# Altium project CanhBaoLu.PrjPcb (part 1 of 2)
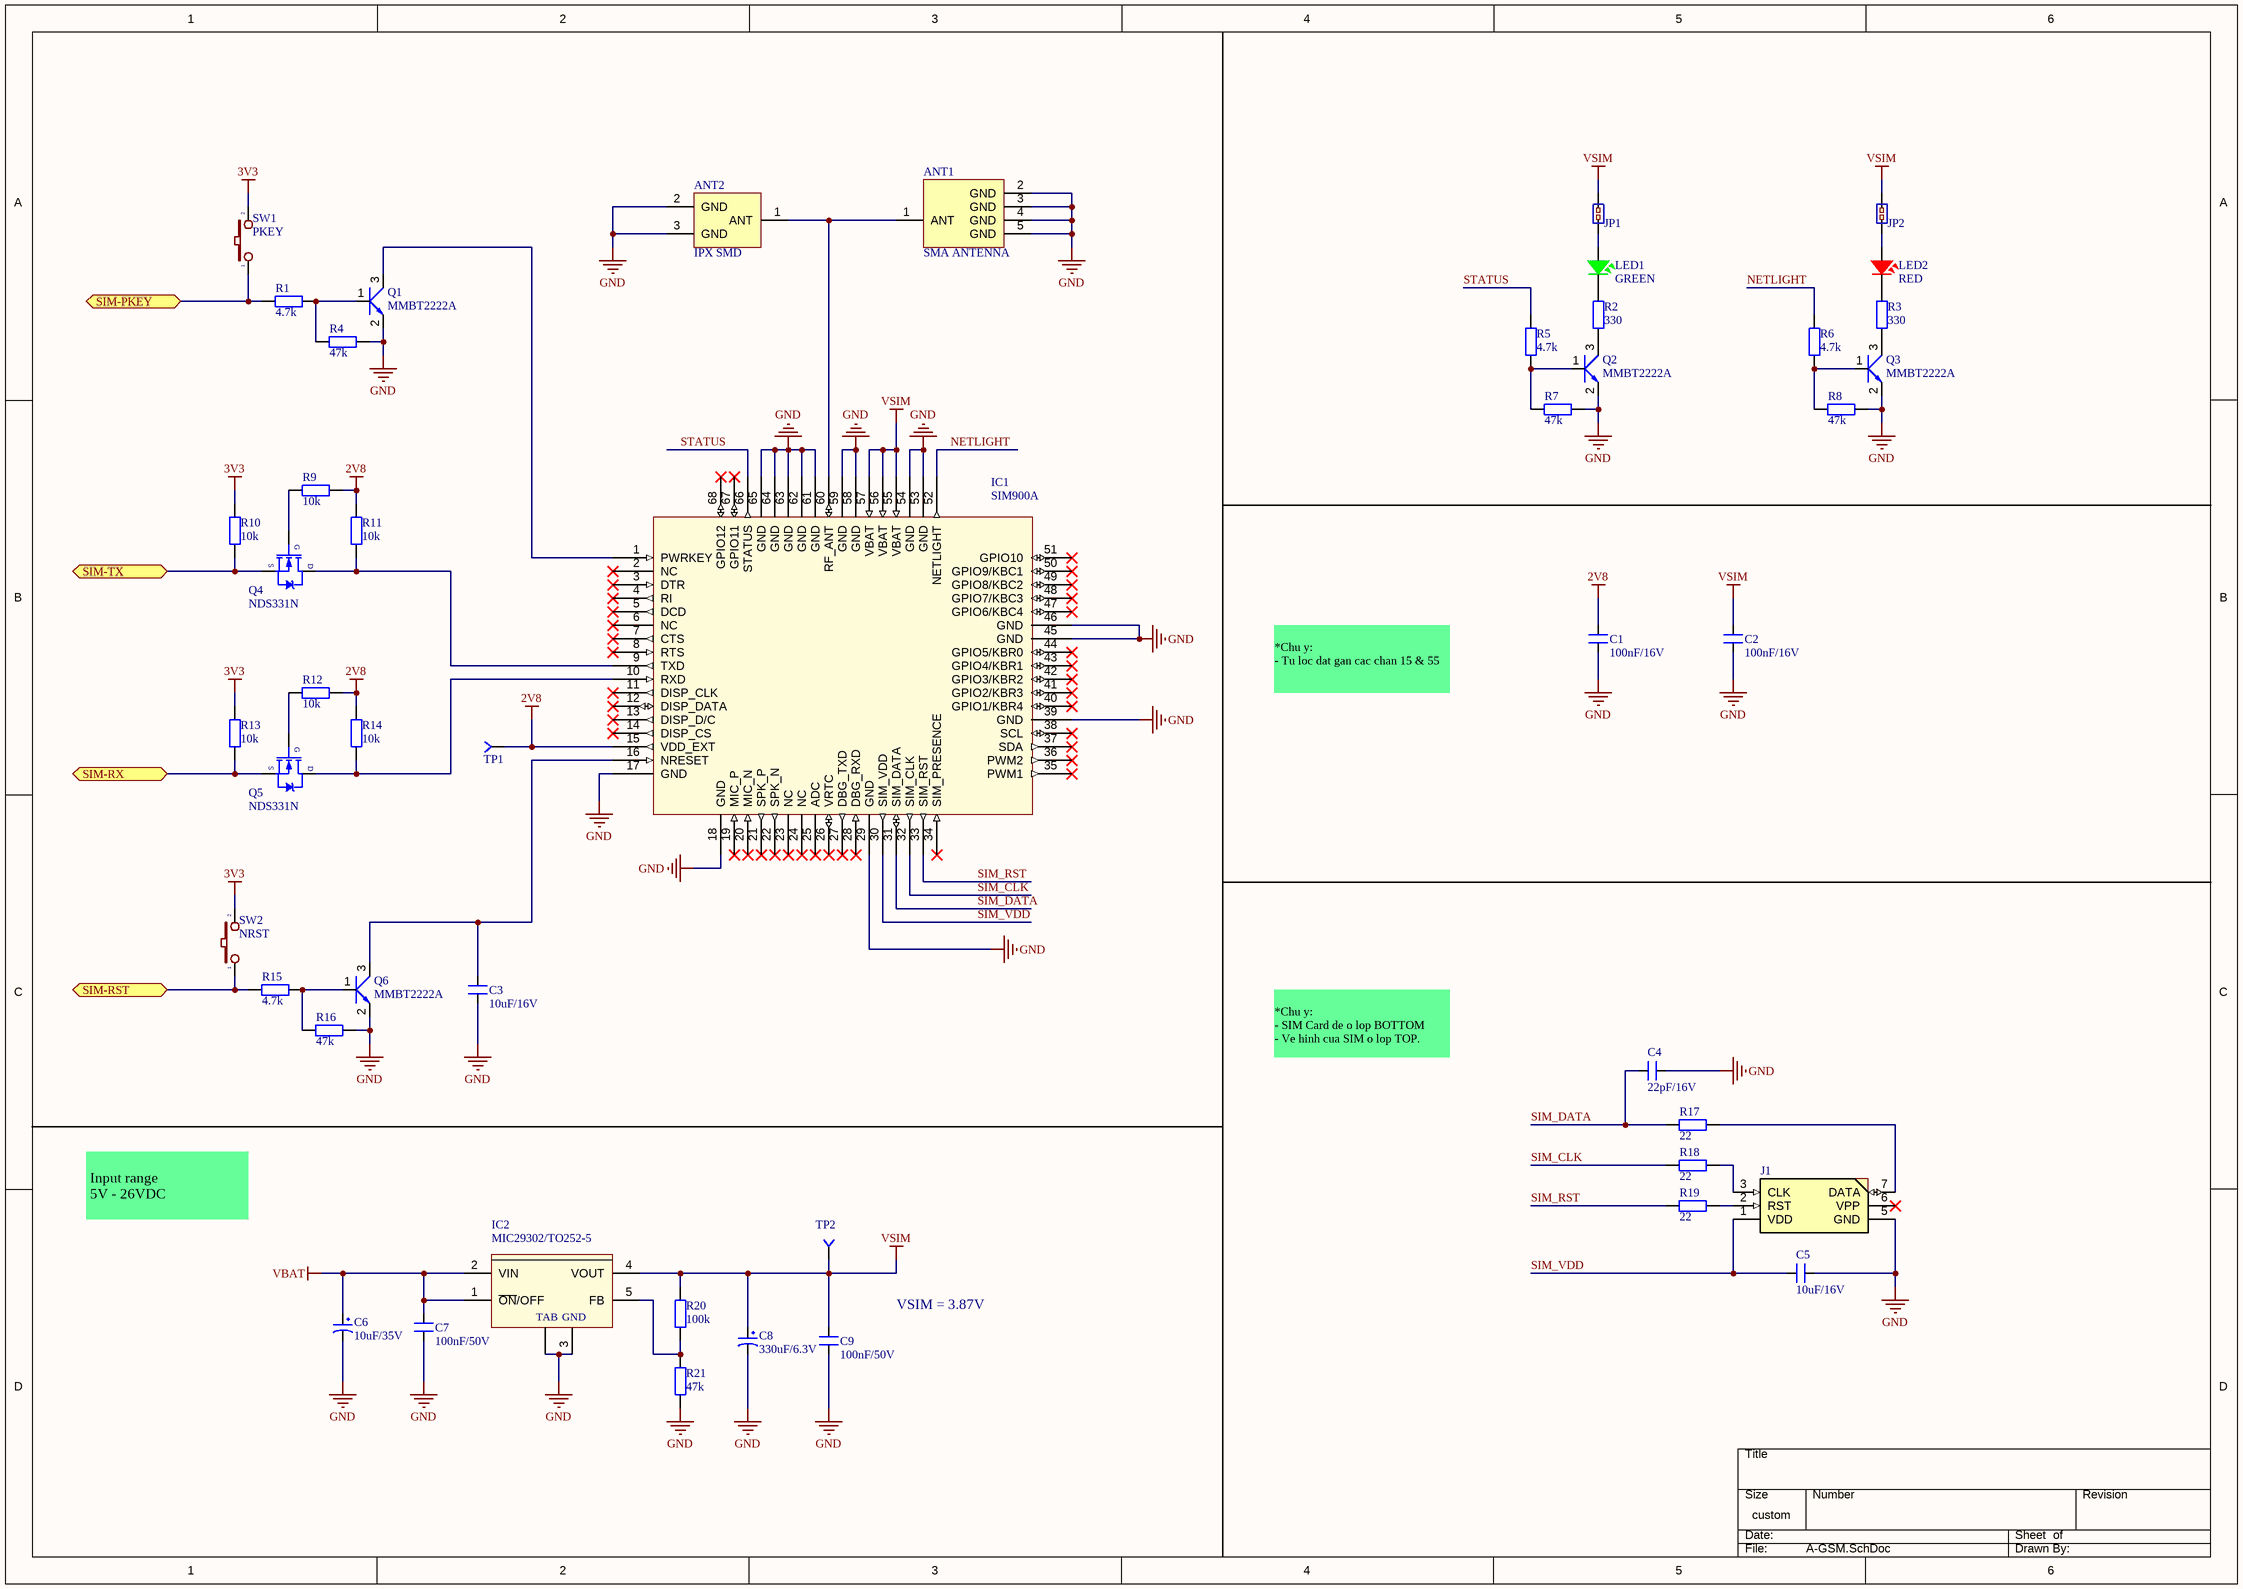
[diagram p0: A-GSM.SchDoc]
3 sheets, 148 parts. Net scope: flat (ports and power ports of the same name join across sheets).
Board file: PCB1.PcbDoc
Sheets:
  A-GSM.SchDoc
  A-Main.SchDoc
  A-Power.SchDoc

## Sheet A-GSM.SchDoc
size 420 x 297 mm; SheetNumber: 02; SheetTotal: 03

### Parts
ANT1  value SMA ANTENNA  [ANT-SMA-ST-F]  (hidden comment: ANTEN-SMA)
ANT2  value IPX SMD  [ANT-IPX-SMD]  (hidden comment: ANTEN-IPX)
C1  100nF/16V  [C0805-2012]
C2  100nF/16V  [C0805-2012]
C3  10uF/16V  [C0805-2012]
C4  22pF/16V  [C0603-1608]
C5  10uF/16V  [C0805-2012]
C6  10uF/35V  [CAP_TANTA_10UF_35V]
C7  100nF/50V  [C0805-2012]
C8  330uF/6.3V  [CAP_TANTA-3528]
C9  100nF/50V  [C0805-2012]
IC1  SIM900A/SIMCOM  [SIM900A]  (value not drawn)
IC2  MIC29302/TO252-5  [MIC29302A]
J1  SIM-FMS006-2620-0  [SIM-FMS006-2620-0]  (value not drawn)
JP1  JP2-ShortingJumper  [Header_2]  (value not drawn)
JP2  JP2-ShortingJumper  [Header_2]  (value not drawn)
LED1  GREEN  [Led 0805G]
LED2  RED  [Led 0805R]
Q1  MMBT2222A  [MMBT2222A]
Q2  MMBT2222A  [MMBT2222A]
Q3  MMBT2222A  [MMBT2222A]
Q4  NDS331N  [NDS331N]
Q5  NDS331N  [NDS331N]
Q6  MMBT2222A  [MMBT2222A]
R1  Resistance (Ohms): 4.7k  [RESC2012(0805)]
R2  Resistance (Ohms): 330  [RESC2012(0805)]
R3  Resistance (Ohms): 330  [RESC2012(0805)]
R4  Resistance (Ohms): 47k  [RESC2012(0805)]
R5  Resistance (Ohms): 4.7k  [RESC2012(0805)]
R6  Resistance (Ohms): 4.7k  [RESC2012(0805)]
R7  Resistance (Ohms): 47k  [RESC2012(0805)]
R8  Resistance (Ohms): 47k  [RESC2012(0805)]
R9  Resistance (Ohms): 10k  [RESC2012(0805)]
R10  Resistance (Ohms): 10k  [RESC2012(0805)]
R11  Resistance (Ohms): 10k  [RESC2012(0805)]
R12  Resistance (Ohms): 10k  [RESC2012(0805)]
R13  Resistance (Ohms): 10k  [RESC2012(0805)]
R14  Resistance (Ohms): 10k  [RESC2012(0805)]
R15  Resistance (Ohms): 4.7k  [RESC2012(0805)]
R16  Resistance (Ohms): 47k  [RESC2012(0805)]
R17  Resistance (Ohms): 22  [RESC2012(0805)]
R18  Resistance (Ohms): 22  [RESC2012(0805)]
R19  Resistance (Ohms): 22  [RESC2012(0805)]
R20  Resistance (Ohms): 100k  [RESC2012(0805)]
R21  Resistance (Ohms): 47k  [RESC2012(0805)]
SW1  PKEY  [BTN-EVQ-11A04M]
SW2  NRST  [BTN-EVQ-11A04M]
TP1  Test Point  [Test_point_VIA06]  (value not drawn)
TP2  Test Point  [Test_point_VIA06]  (value not drawn)

### Ports
SIM-PKEY (bidir), SIM-RST (bidir), SIM-RX (bidir), SIM-TX (bidir)

### Nets
2V8: C1.1 IC1.15(VDD_EXT) R9.2 R11.1 R12.2 R14.1 TP1.1
3V3: R10.1 R13.1 SW1.2 SW2.2
GND: ANT1.2(GND) ANT1.3(GND) ANT1.4(GND) ANT1.5(GND) ANT2.2(GND) ANT2.3(GND) C1.2 C2.2 C3.2 C4.2 C5.2 C6.2 C7.2 C8.2 C9.2 IC1.17(GND) IC1.18(GND) IC1.29(GND) IC1.39(GND) IC1.45(GND) IC1.46(GND) IC1.53(GND) IC1.54(GND) IC1.58(GND) IC1.59(GND) IC1.61(GND) IC1.62(GND) IC1.63(GND) IC1.64(GND) IC1.65(GND) IC2.3(GND) IC2.6(TAB) J1.5(GND) Q1.2(E) Q2.2(E) Q3.2(E) Q6.2(E) R4.2 R7.2 R8.2 R16.2 R21.1
VBAT: C6.1 C7.1 IC2.1(~{ON}/OFF) IC2.2(VIN)
VSIM: C2.1 C8.1 C9.1 IC1.55(VBAT) IC1.56(VBAT) IC1.57(VBAT) IC2.4(VOUT) JP1.2 JP2.2 R20.1 TP2.1
NETLIGHT: IC1.52(NETLIGHT) R6.2
SIM_CLK: IC1.32(SIM_CLK) R18.2
SIM_DATA: C4.1 IC1.31(SIM_DATA) R17.2
SIM_RST: IC1.33(SIM_RST) R19.2
SIM_VDD: C5.1 IC1.30(SIM_VDD) J1.1(VDD)
STATUS: IC1.66(STATUS) R5.2
NetANT1_1: ANT1.1(ANT) ANT2.1(ANT) IC1.60(RF_ANT)
NetC3_1: C3.1 IC1.16(NRESET) Q6.3(C)
NetIC1_1: IC1.1(PWRKEY) Q1.3(C)
NetIC1_9: IC1.9(TXD) Q4.3(D) R11.2
NetIC1_10: IC1.10(RXD) Q5.3(D) R14.2
NetIC2_5: IC2.5(FB) R20.2 R21.2
NetJ1_2: J1.2(RST) R19.1
NetJ1_3: J1.3(CLK) R18.1
NetJ1_7: J1.7(DATA) R17.1
NetJP1_1: JP1.1 LED1.1(A)
NetJP2_1: JP2.1 LED2.1(A)
NetLED1_2: LED1.2(K) R2.2
NetLED2_2: LED2.2(K) R3.2
NetQ1_1: Q1.1(B) R1.2 R4.1
NetQ2_1: Q2.1(B) R5.1 R7.1
NetQ2_3: Q2.3(C) R2.1
NetQ3_1: Q3.1(B) R6.1 R8.1
NetQ3_3: Q3.3(C) R3.1
NetQ4_1: Q4.1(G) R9.1
NetQ4_2: Q4.2(S) R10.2 ; port SIM-TX
NetQ5_1: Q5.1(G) R12.1
NetQ5_2: Q5.2(S) R13.2 ; port SIM-RX
NetQ6_1: Q6.1(B) R15.2 R16.1
NetR1_1: R1.1 SW1.1 ; port SIM-PKEY
NetR15_1: R15.1 SW2.1 ; port SIM-RST

Not connected (* = marked no-connect by the designer): IC1 2(NC)* 3(DTR)* 4(RI)* 5(DCD)* 6(NC)* 7(CTS)* 8(RTS)* 11(DISP_CLK)* 12(DISP_DATA)* 13(DISP_D/C)* 14(DISP_CS)* 19(MIC_P)* 20(MIC_N)* 21(SPK_P)* 22(SPK_N)* 23(NC)* 24(NC)* 25(ADC)* 26(VRTC)* 27(DBG_TXD)* 28(DBG_RXD)* 34(SIM_PRESENCE)* 35(PWM1)* 36(PWM2)* 37(SDA)* 38(SCL)* 40(GPIO1/KBR4)* 41(GPIO2/KBR3)* 42(GPIO3/KBR2)* 43(GPIO4/KBR1)* 44(GPIO5/KBR0)* 47(GPIO6/KBC4)* 48(GPIO7/KBC3)* 49(GPIO8/KBC2)* 50(GPIO9/KBC1)* 51(GPIO10)* 67(GPIO11)* 68(GPIO12)*; J1 6(VPP)*

### Notes on the sheet
- *Chu y:
  - Tu loc dat gan cac chan 15 & 55
- *Chu y:
  - SIM Card de o lop BOTTOM
  - Ve hinh cua SIM o lop TOP.
- Input range
  5V - 26VDC
- VSIM = 3.87V
- THIS DOCUMENT AND THE DATA DISCLOSED HEREIN OR
- HEREWITH IS THE PROPERTY OF ALTIUM LIMITED AND MAY
- DWG NO:
- REVISION
- REV:
- DESCRIPTION
- DATE
- APPROVED
- BE FREELY DISTRIBUTED IN WHOLE. NO RIGHTS ARE
- RESERVED OR EXPRESS OR IMPLIED WARANTEE GIVEN.
- ENG:
- APPROVALS
- PROJECT
- DSN:
- CHK:
- REFERENCE DOCUMENTS
- PROJECT REVISION:
- TITLE
- DOCUMENT REVISION:
- DESIGN ITEM:
- BOM:
- FAB DWG:
- PCB DWG:
- ASSY DWG:
- SCALE:
- A3
- SIZE
- CAGE CODE
- FILE NAME
- DWG NO.
- SHEET
- OF
- REV

### Library data of the parts
ANT1 = ANTEN-SMA: SMA Right-Angle PCB Female Antenna; Supplier Link: http://tme.vn/Product.aspx?id=1981#page=pro_info; ComponentLink1Description: http://tme.vn/upload/PICTURE/SMA-ST-DIM.gif; ComponentLink1URL: http://tme.vn/upload/PICTURE/SMA-ST-DIM.gif; Supplier 1: TME.VN
ANT2 = ANTEN-IPX: IPX, SMD, ANTENNA; Supplier Link: http://tme.vn/Product.aspx?id=1106#page=pro_info; ComponentLink1Description: http://tme.vn/upload/pdf/IPXSM66AL.pdf; ComponentLink1URL: http://tme.vn/upload/pdf/IPXSM66AL.pdf; Supplier 1: TME.VN
C1 C2 = CAP-CER/100nF/16V/X7R/0805: CAP CER 0.1UF 16V X7R 0805; Manufacturer: Kemet; Manufacturer Part Number: C0805C104K4RACTU; Capacitance: 0.10µF; Tolerance: ±10%; Supplier 1: Digi-Key; RoHS: RoHS Compliant; Category: Capacitors; Stock 1: 366123; Pricing 1: 1=0.11, 10=0.075, 50=0.0432, 100=0.0356, 250=0.03, 500=0.02512, 1000=0.02063 (USD); Packaging: Cut Tape (CT); Voltage - Rated: 16V; Temperature Coefficient: X7R; Mounting Type: Surface Mount, MLCC; Operating Temperature: -55°C ~ 125°C; Applications: General Purpose; Ratings: -; Package / Case: 0805 (2012 Metric); Size / Dimension: 0.079" L x 0.049" W (2.00mm x 1.25mm); Height - Seated (Max): -; Thickness (Max): 0.035" (0.88mm); Lead Spacing: -; Features: Low ESL; Lead Style: -; ComponentLink1URL: http://www.kemet.com/docfinder?Partnumber=C0805C104K4RACTU; ComponentLink1Description: http://www.kemet.com/docfinder?Partnumber=C0805C104K4RACTU; Supplier Part Number 1: 399-1167-1-ND
C3 C5 = CAP-CER/10UF/16V/X5R/0805: CAP CER 10UF 16V X5R 0805; Manufacturer: Murata Electronics North America; Manufacturer Part Number: GRM21BR61C106KE15L; Capacitance: 10µF; Tolerance: ±10%; Supplier 1: Digi-Key; Supplier Part Number 1: 490-3886-1-ND; Stock: 1364697; Pricing: 1=0.2, 10=0.136, 50=0.0826, 100=0.0693, 250=0.05612, 500=0.0495, 1000=0.04208 (USD); Packaging: Cut Tape (CT); Voltage - Rated: 16V; Temperature Coefficient: X5R; Mounting Type: Surface Mount, MLCC; Operating Temperature: -55°C ~ 85°C; Applications: General Purpose; Ratings: -; Package / Case: 0805 (2012 Metric); Size / Dimension: 0.079" L x 0.049" W (2.00mm x 1.25mm); Height - Seated (Max): -; Thickness (Max): 0.053" (1.35mm); Lead Spacing: -; Features: -; Lead Style: -; ComponentLink1URL: http://www.murata.com/~/media/webrenewal/support/library/catalog/products/capacitor/mlcc/c02e.ashx; ComponentLink1Description: http://www.murata.com/~/media/webrenewal/support/library/catalog/products/capacitor/mlcc/c02e.ashx
C4 = CAP-CER/22pF/16V/NP0/0603: CAP CER 22PF 16V NP0 0603; Manufacturer: Kemet; Manufacturer Part Number: C0603C220K4GACTU; Tolerance: ±10%; Temperature Coefficient: C0G, NP0; Supplier 1: Digi-Key; Supplier Part Number 1: 399-9031-1-ND; Stock: 40435; Pricing: 1=0.1, 10=0.055, 25=0.0392, 50=0.0298, 100=0.0252, 250=0.02064, 1000=0.0135 (USD); Packaging: Cut Tape (CT); Capacitance: 22pF; Voltage - Rated: 16V; Mounting Type: Surface Mount, MLCC; Operating Temperature: -55°C ~ 125°C; Applications: General Purpose; Ratings: -; Package / Case: 0603 (1608 Metric); Size / Dimension: 0.063" L x 0.031" W (1.60mm x 0.80mm); Height - Seated (Max): -; Thickness (Max): 0.034" (0.87mm); Lead Spacing: -; Features: -; Lead Style: -; ComponentLink1URL: http://www.kemet.com/docfinder?Partnumber=C0603C220K4GACTU; ComponentLink1Description: http://www.kemet.com/docfinder?Partnumber=C0603C220K4GACTU
C6 = CAP-TANT/10uF/35V/2413: CAP TANT 10UF 35V 10% 2413; Manufacturer: Kemet; Manufacturer Part Number: T491C106K035AT; Manufacturer Size Code: C; Capacitance: 10µF; ESR (Equivalent Series Resistance): 1.6 Ohm; Type: Molded; Lifetime @ Temp.: 2000 Hrs @ 85°C; Supplier 1: Digi-Key; RoHS: RoHS Compliant; Category: Capacitors; Stock 1: 21227; Pricing 1: 1=0.99, 10=0.838, 50=0.6166, 100=0.4901, 250=0.41108 (USD); Packaging: Cut Tape (CT); Tolerance: ±10%; Voltage - Rated: 35V; Operating Temperature: -55°C ~ 125°C; Mounting Type: Surface Mount; Package / Case: 2413 (6032 Metric); Size / Dimension: 0.236" L x 0.126" W (6.00mm x 3.20mm); Height - Seated (Max): 0.110" (2.80mm); Lead Spacing: -; Features: General Purpose; ComponentLink1URL: http://www.kemet.com/Lists/ProductCatalog/Attachments/254/KEM_T2005_T491.pdf; ComponentLink1Description: http://www.kemet.com/Lists/ProductCatalog/Attachments/254/KEM_T2005_T491.pdf; Supplier Part Number 1: 399-8333-1-ND
C7 C9 = CAP-CER/100nF/50V/X7R/0805: CAP CER 0.1UF 50V X7R 0805; Manufacturer: AVX Corporation; Manufacturer Part Number: 08055C104KAT2A; Capacitance: 0.10µF; Tolerance: ±10%; Supplier 1: Digi-Key; RoHS: RoHS Compliant; Category: Capacitors; Stock 1: 6127704; Pricing 1: 1=0.1, 10=0.036, 100=0.0165, 250=0.01352, 500=0.01156, 1000=0.009 (USD); Packaging: Cut Tape (CT); Voltage - Rated: 50V; Temperature Coefficient: X7R; Mounting Type: Surface Mount, MLCC; Operating Temperature: -55°C ~ 125°C; Applications: General Purpose; Ratings: -; Package / Case: 0805 (2012 Metric); Size / Dimension: 0.079" L x 0.049" W (2.01mm x 1.25mm); Height - Seated (Max): -; Thickness (Max): 0.037" (0.94mm); Lead Spacing: -; Features: -; Lead Style: -; ComponentLink1URL: http://datasheets.avx.com/X7RDielectric.pdf; ComponentLink1Description: http://datasheets.avx.com/X7RDielectric.pdf; Supplier Part Number 1: 478-1395-1-ND
C8 = CAP-TANT/330uF/6.3V/3528: CAP TAN 330UF 20% 6V 3528-21; Manufacturer: Kemet; Manufacturer Part Number: T490B337M006ATE800; Manufacturer Size Code: B; Capacitance: 330µF; Voltage - Rated: 6.3V; ESR (Equivalent Series Resistance): 800 mOhm; Type: Molded; Lifetime @ Temp.: 1000 Hrs @ 85°C; Supplier 1: Digi-Key; RoHS: RoHS Compliant; Category: Capacitors; Stock 1: 5471; Pricing 1: 1=1.21, 10=1.011, 50=0.817, 100=0.645, 250=0.53752, 500=0.48376, 1000=0.44075 (USD); Packaging: Cut Tape (CT); Tolerance: ±20%; Operating Temperature: -55°C ~ 40°C; Mounting Type: Surface Mount; Package / Case: 1411 (3528 Metric); Size / Dimension: 0.138" L x 0.110" W (3.50mm x 2.80mm); Height - Seated (Max): 0.083" (2.10mm); Lead Spacing: -; Features: General Purpose; ComponentLink1URL: http://capacitoredge.kemet.com/capedge2/DataSheet?pn=T490B337M006ATE800; ComponentLink1Description: http://capacitoredge.kemet.com/capedge2/DataSheet?pn=T490B337M006ATE800; Supplier Part Number 1: 399-11976-1-ND
IC1 = SIM900A/SIMCOM: SIM900A, Dual-band GSM/GPRS 900/1800MHz Module; Manufacturer: SIMCOM; ComponentLink1Description: http://www.tme.vn/upload/pdf/SIM900A_HD_V1.01.pdf; Supplier Link: http://www.tme.vn/Product.aspx?id=1575#page=pro_info; ComponentLink1URL: http://www.tme.vn/upload/pdf/SIM900A_HD_V1.01.pdf; Manufacturer Part Number: SIM900A
IC2 = MIC29302/TO252-5: IC REG LDO ADJ 3A TO252-5; Manufacturer: Microchip Technology; Manufacturer Part Number: MIC29302AWD-TR; Regulator Topology: Positive Adjustable; Voltage - Output: 1.24 V ~ 15 V; Voltage - Dropout (Typical): 0.45V @ 3A; Number of Regulators: 1; Voltage - Input: 3 V ~ 16 V; Datasheet: http://www.micrel.com/_PDF/mic29150.pdf; Supplier VN: http://thegioiic.com/products/mic29302; Supplier 1: Digi-Key; RoHS: RoHS Compliant; Category: Integrated Circuits (ICs); Stock 1: 4076; Pricing 1: 1=1.87, 25=1.56, 100=1.42 (USD); Packaging: Cut Tape (CT); Current - Output: 3A; Current - Limit (Min): 3A; Operating Temperature: -40°C ~ 125°C; Mounting Type: Surface Mount; Package / Case: TO-263-6, D²Pak (5 Leads + Tab), TO-263BA; Supplier Device Package: TO-252-5; ComponentLink1URL: http://www.microchip.com/mymicrochip/filehandler.aspx?ddocname=en580808; ComponentLink1Description: http://www.microchip.com/mymicrochip/filehandler.aspx?ddocname=en580808; Supplier Part Number 1: 576-4106-1-ND
J1 = SIM-FMS006-2620-0: SIM Card Conn 6-Pin Top, Mount, Push-Push; Manufacturer Part Number 1: FMS006-2620-0; Supplier Link: http://tme.vn/Product.aspx?id=599#page=pro_info; ComponentLink1Description: http://www.mouser.com/ds/2/448/c_fms006_2620-4530.pdf; ComponentLink1URL: http://www.mouser.com/ds/2/448/c_fms006_2620-4530.pdf; Supplier 1: TME.VN
JP1 JP2 = JP2-ShortingJumper: 2.54mm 2-Pin Shorting Jumper; Value: Shorting Jumper; Supplier Link: http://tme.vn/Product.aspx?id=509#page=pro_info
LED1 = LED-GREEN/CLEAR/0805: LED GREEN CLEAR 0805 SMD; Manufacturer: Lite-On Inc.; Manufacturer Part Number: LTST-C171GKT; Wavelength - Dominant: 569nm; Wavelength - Peak: 565nm; Millicandela Rating: 12mcd; Voltage - Forward (Vf) (Typ): 2.1V; Current - Test: 20mA; Viewing Angle: 130°; Lens Color: Colorless; Lens Style/Size: Rectangle with Flat Top, 1.40mm x 1.25mm; Supplier 1: Digi-Key; Supplier Part Number 1: 160-1423-1-ND; Stock: 159350; Pricing: 1=0.25, 10=0.2, 100=0.1091, 250=0.07272, 500=0.06182, 1000=0.04727 (USD); Packaging: Cut Tape (CT); Color: Green; Lens Transparency: Clear; Package / Case: 0805 (2012 Metric); Supplier Device Package: Chip LED; Size / Dimension: 2.00mm L x 1.25mm W; Height (Max): 0.80mm; Mounting Type: Surface Mount; ComponentLink1URL: http://media.digikey.com/pdf/Data%20Sheets/Lite-On%20PDFs/LTST-C171GKT.pdf; ComponentLink1Description: http://media.digikey.com/pdf/Data%20Sheets/Lite-On%20PDFs/LTST-C171GKT.pdf
LED2 = LED-RED/CLEAR/0805: LED RED CLEAR 0805 SMD; Manufacturer: Lite-On Inc.; Manufacturer Part Number: LTST-C171KRKT; Wavelength - Dominant: 631nm; Wavelength - Peak: 639nm; Millicandela Rating: 54mcd; Voltage - Forward (Vf) (Typ): 2V; Current - Test: 20mA; Viewing Angle: 130°; Lens Color: Colorless; Lens Style/Size: Rectangle with Flat Top, 1.40mm x 1.25mm; Supplier 1: Digi-Key; Supplier Part Number 1: 160-1427-1-ND; Stock: 74706; Pricing: 1=0.27, 10=0.213, 100=0.1161, 250=0.0774, 500=0.0658, 1000=0.05031 (USD); Packaging: Cut Tape (CT); Color: Red; Lens Transparency: Clear; Package / Case: 0805 (2012 Metric); Supplier Device Package: *; Size / Dimension: 2.00mm L x 1.25mm W; Height (Max): 0.80mm; Mounting Type: Surface Mount; ComponentLink1URL: http://optoelectronics.liteon.com/upload/download/DS22-2000-109/S_110_LTST-C171KRKT.pdf; ComponentLink1Description: http://optoelectronics.liteon.com/upload/download/DS22-2000-109/S_110_LTST-C171KRKT.pdf
Q1-Q3 Q6 = BJT-MMBT2222A/SOT23: TRANS NPN 40V 0.6A SOT23; Manufacturer: ON Semiconductor; Manufacturer Part Number: MMBT2222ALT1G; Current - Collector (Ic) (Max): 600mA; Vce Saturation (Max) @ Ib, Ic: 1V @ 50mA, 500mA; Current - Collector Cutoff (Max): 10nA (ICBO); DC Current Gain (hFE) (Min) @ Ic, Vce: 100 @ 150mA, 10V; Power - Max: 300mW; Frequency - Transition: 300MHz; Supplier 1: Digi-Key; RoHS: RoHS Compliant; Category: Discrete Semiconductor Products; Stock 1: 416765; Pricing 1: 1=0.1, 10=0.095, 100=0.0516, 500=0.03172, 1000=0.02163 (USD); Packaging: Cut Tape (CT); Transistor Type: NPN; Voltage - Collector Emitter Breakdown (Max): 40V; Mounting Type: Surface Mount; Package / Case: TO-236-3, SC-59, SOT-23-3; Supplier Device Package: SOT-23; ComponentLink1URL: http://www.onsemi.com/pub_link/Collateral/MMBT2222LT1-D.PDF; ComponentLink1Description: http://www.onsemi.com/pub_link/Collateral/MMBT2222LT1-D.PDF; Supplier Part Number 1: MMBT2222ALT1GOSCT-ND
Q4 Q5 = MOSFET-NDS331N/SSOT3: MOSFET N-CH 20V 1.3A SSOT3; Manufacturer: Fairchild Semiconductor; FET Type: MOSFET N-Channel, Metal Oxide; FET Feature: Logic Level Gate; Current - Continuous Drain (Id) @ 25°C: 1.3A (Ta); Rds On (Max) @ Id, Vgs: 160 mOhm @ 1.5A, 4.5V; Vgs(th) (Max) @ Id: 1V @ 250µA; Gate Charge (Qg) @ Vgs: 5nC @ 4.5V; Input Capacitance (Ciss) @ Vds: 162pF @ 10V; Power - Max: 460mW; Supplier 1: Digi-Key; Manufacturer Part Number: NDS331N; RoHS: RoHS Compliant; Category: Discrete Semiconductor Products; Stock 1: 10641; Pricing 1: 1=0.44, 10=0.33, 100=0.2058, 500=0.1407, 1000=0.10815 (USD); Packaging: Cut Tape (CT); Drain to Source Voltage (Vdss): 20V; Operating Temperature: -55°C ~ 150°C (TJ); Mounting Type: Surface Mount; Package / Case: TO-236-3, SC-59, SOT-23-3; Supplier Device Package: SuperSOT-3; ComponentLink1URL: http://www.fairchildsemi.com/datasheets/ND/NDS331N.pdf; ComponentLink1Description: http://www.fairchildsemi.com/datasheets/ND/NDS331N.pdf; Supplier Part Number 1: NDS331NCT-ND
R1 R5 R6 R15 = RES-0805/±5%: RES SMD 4.7K OHM 5% 1/8W 0805; Manufacturer: Yageo; Manufacturer Part Number: RC0805JR-074K7L; Power (Watts): 0.125W, 1/8W; Temperature Coefficient: ±100ppm/°C; Supplier 1: Digi-Key; Supplier Part Number 1: 311-4.7KARCT-ND; RoHS: RoHS Compliant; Category: Resistors; Stock 1: 891032; Pricing 1: 1=0.1, 10=0.018, 25=0.0128, 100=0.0073, 250=0.00556, 500=0.00444, 1000=0.00326, 2500=0.00283 (USD); Packaging: Cut Tape (CT); Tolerance: ±5%; Composition: Thick Film; Features: Moisture Resistant; Operating Temperature: -55°C ~ 155°C; Package / Case: 0805 (2012 Metric); Supplier Device Package: 0805; Size / Dimension: 0.079" L x 0.049" W (2.00mm x 1.25mm); Height: 0.024" (0.60mm); Number of Terminations: 2; ComponentLink1URL: http://www.yageo.com/documents/recent/PYu-RC_Group_51_RoHS_L_04.pdf; ComponentLink1Description: http://www.yageo.com/documents/recent/PYu-RC_Group_51_RoHS_L_04.pdf
R2 R3 = RES-0805/±5%: RES SMD 330 OHM 5% 1/8W 0805; Manufacturer: Yageo; Manufacturer Part Number: RC0805JR-07330RL; Power (Watts): 0.125W, 1/8W; Temperature Coefficient: ±100ppm/°C; Supplier 1: Digi-Key; Supplier Part Number 1: 311-330ARCT-ND; RoHS: RoHS Compliant; Category: Resistors; Stock 1: 538867; Pricing 1: 1=0.1, 10=0.018, 25=0.0128, 100=0.0073, 250=0.00556, 500=0.00444, 1000=0.00326, 2500=0.00283 (USD); Packaging: Cut Tape (CT); Tolerance: ±5%; Composition: Thick Film; Features: Moisture Resistant; Operating Temperature: -55°C ~ 155°C; Package / Case: 0805 (2012 Metric); Supplier Device Package: 0805; Size / Dimension: 0.079" L x 0.049" W (2.00mm x 1.25mm); Height: 0.024" (0.60mm); Number of Terminations: 2; ComponentLink1URL: http://www.yageo.com/documents/recent/PYu-RC_Group_51_RoHS_L_04.pdf; ComponentLink1Description: http://www.yageo.com/documents/recent/PYu-RC_Group_51_RoHS_L_04.pdf
R4 R7 R8 R16 R21 = RES-0805/±5%: RES SMD 47K OHM 5% 1/8W 0805; Manufacturer: Yageo; Manufacturer Part Number: RC0805JR-0747KL; Power (Watts): 0.125W, 1/8W; Temperature Coefficient: ±100ppm/°C; Supplier 1: Digi-Key; Supplier Part Number 1: 311-47KARCT-ND; RoHS: RoHS Compliant; Category: Resistors; Stock 1: 595084; Pricing 1: 1=0.1, 10=0.018, 25=0.0128, 100=0.0073, 250=0.00556, 500=0.00444, 1000=0.00326, 2500=0.00283 (USD); Packaging: Cut Tape (CT); Tolerance: ±5%; Composition: Thick Film; Features: Moisture Resistant; Operating Temperature: -55°C ~ 155°C; Package / Case: 0805 (2012 Metric); Supplier Device Package: 0805; Size / Dimension: 0.079" L x 0.049" W (2.00mm x 1.25mm); Height: 0.024" (0.60mm); Number of Terminations: 2; ComponentLink1URL: http://www.yageo.com/documents/recent/PYu-RC_Group_51_RoHS_L_04.pdf; ComponentLink1Description: http://www.yageo.com/documents/recent/PYu-RC_Group_51_RoHS_L_04.pdf
R9-R14 = RES-0805/±5%: RES SMD 10K OHM 5% 1/8W 0805; Manufacturer: Yageo; Manufacturer Part Number: RC0805JR-0710KL; Power (Watts): 0.125W, 1/8W; Temperature Coefficient: ±100ppm/°C; Supplier 1: Digi-Key; Supplier Part Number 1: 311-10KARCT-ND; RoHS: RoHS Compliant; Category: Resistors; Stock 1: 1117583; Pricing 1: 1=0.1, 10=0.018, 25=0.0128, 100=0.0073, 250=0.00556, 500=0.00444, 1000=0.00326, 2500=0.00283 (USD); Packaging: Cut Tape (CT); Tolerance: ±5%; Composition: Thick Film; Features: Moisture Resistant; Operating Temperature: -55°C ~ 155°C; Package / Case: 0805 (2012 Metric); Supplier Device Package: 0805; Size / Dimension: 0.079" L x 0.049" W (2.00mm x 1.25mm); Height: 0.024" (0.60mm); Number of Terminations: 2; ComponentLink1URL: http://www.yageo.com/documents/recent/PYu-RC_Group_51_RoHS_L_04.pdf; ComponentLink1Description: http://www.yageo.com/documents/recent/PYu-RC_Group_51_RoHS_L_04.pdf
R17-R19 = RES-0805/±5%: RES SMD 22 OHM 5% 1/8W 0805; Manufacturer: Yageo; Manufacturer Part Number: RC0805JR-0722RL; Power (Watts): 0.125W, 1/8W; Temperature Coefficient: ±100ppm/°C; Supplier 1: Digi-Key; Supplier Part Number 1: 311-22ARCT-ND; RoHS: RoHS Compliant; Category: Resistors; Stock 1: 128230; Pricing 1: 1=0.1, 10=0.018, 25=0.0128, 100=0.0073, 250=0.00556, 500=0.00444, 1000=0.00326, 2500=0.00283 (USD); Packaging: Cut Tape (CT); Tolerance: ±5%; Composition: Thick Film; Features: Moisture Resistant; Operating Temperature: -55°C ~ 155°C; Package / Case: 0805 (2012 Metric); Supplier Device Package: 0805; Size / Dimension: 0.079" L x 0.049" W (2.00mm x 1.25mm); Height: 0.024" (0.60mm); Number of Terminations: 2; ComponentLink1URL: http://www.yageo.com/documents/recent/PYu-RC_Group_51_RoHS_L_04.pdf; ComponentLink1Description: http://www.yageo.com/documents/recent/PYu-RC_Group_51_RoHS_L_04.pdf
R20 = RES-0805/±5%: RES SMD 100K OHM 5% 1/8W 0805; Manufacturer: Yageo; Manufacturer Part Number: RC0805JR-07100KL; Power (Watts): 0.125W, 1/8W; Temperature Coefficient: ±100ppm/°C; Supplier 1: Digi-Key; Supplier Part Number 1: 311-100KARCT-ND; RoHS: RoHS Compliant; Category: Resistors; Stock 1: 312208; Pricing 1: 1=0.1, 10=0.018, 25=0.0128, 100=0.0073, 250=0.00556, 500=0.00444, 1000=0.00326, 2500=0.00283 (USD); Packaging: Cut Tape (CT); Tolerance: ±5%; Composition: Thick Film; Features: Moisture Resistant; Operating Temperature: -55°C ~ 155°C; Package / Case: 0805 (2012 Metric); Supplier Device Package: 0805; Size / Dimension: 0.079" L x 0.049" W (2.00mm x 1.25mm); Height: 0.024" (0.60mm); Number of Terminations: 2; ComponentLink1URL: http://www.yageo.com/documents/recent/PYu-RC_Group_51_RoHS_L_04.pdf; ComponentLink1Description: http://www.yageo.com/documents/recent/PYu-RC_Group_51_RoHS_L_04.pdf
SW1 SW2 = SW2-PUSH/SPST/NO: SWITCH TACTILE SPST-NO 0.02A 15V; Manufacturer: Panasonic Electronic Components; Manufacturer Part Number: EVQ-11A04M; Switch Function: Off-Mom; Contact Rating @ Voltage: 0.02A @ 15VDC; Actuator Type: Standard; Actuator Height off PCB, from Pins: 4.30mm; Actuator Orientation: Top Actuated; Outline: 6.00mm x 6.00mm; Illumination: Non-Illuminated; Operating Force: 100gf; Switch Travel: 0.25mm; Mechanical Life: 100,000 Cycles; Supplier 1: Digi-Key; RoHS: RoHS Compliant; Category: Switches; Stock 1: 4758; Pricing 1: 1=0.29, 10=0.273, 25=0.2344, 50=0.1992, 100=0.1913, 250=0.17184, 500=0.16402, 1000=0.13668 (USD); Packaging: Cut Tape (CT); Circuit: SPST-NO; Mounting Type: Through Hole; Termination Style: PC Pin; Illumination Voltage (Nominal): -; Illumination Type, Color: -; Ingress Protection: -; Features: -; Actuator Material: -; Operating Temperature: -20°C ~ 70°C; ComponentLink1URL: http://industrial.panasonic.com/cdbs/www-data/pdf/ATK0000/ATK0000CE11.pdf; ComponentLink1Description: http://industrial.panasonic.com/cdbs/www-data/pdf/ATK0000/ATK0000CE11.pdf; Supplier Part Number 1: P8070SCT-ND
TP1 TP2 = Connector-TP: Test Point, Pad, Hole; Value: Not a component

## Sheet A-Main.SchDoc
size A3; SheetNumber: 01; SheetTotal: 03
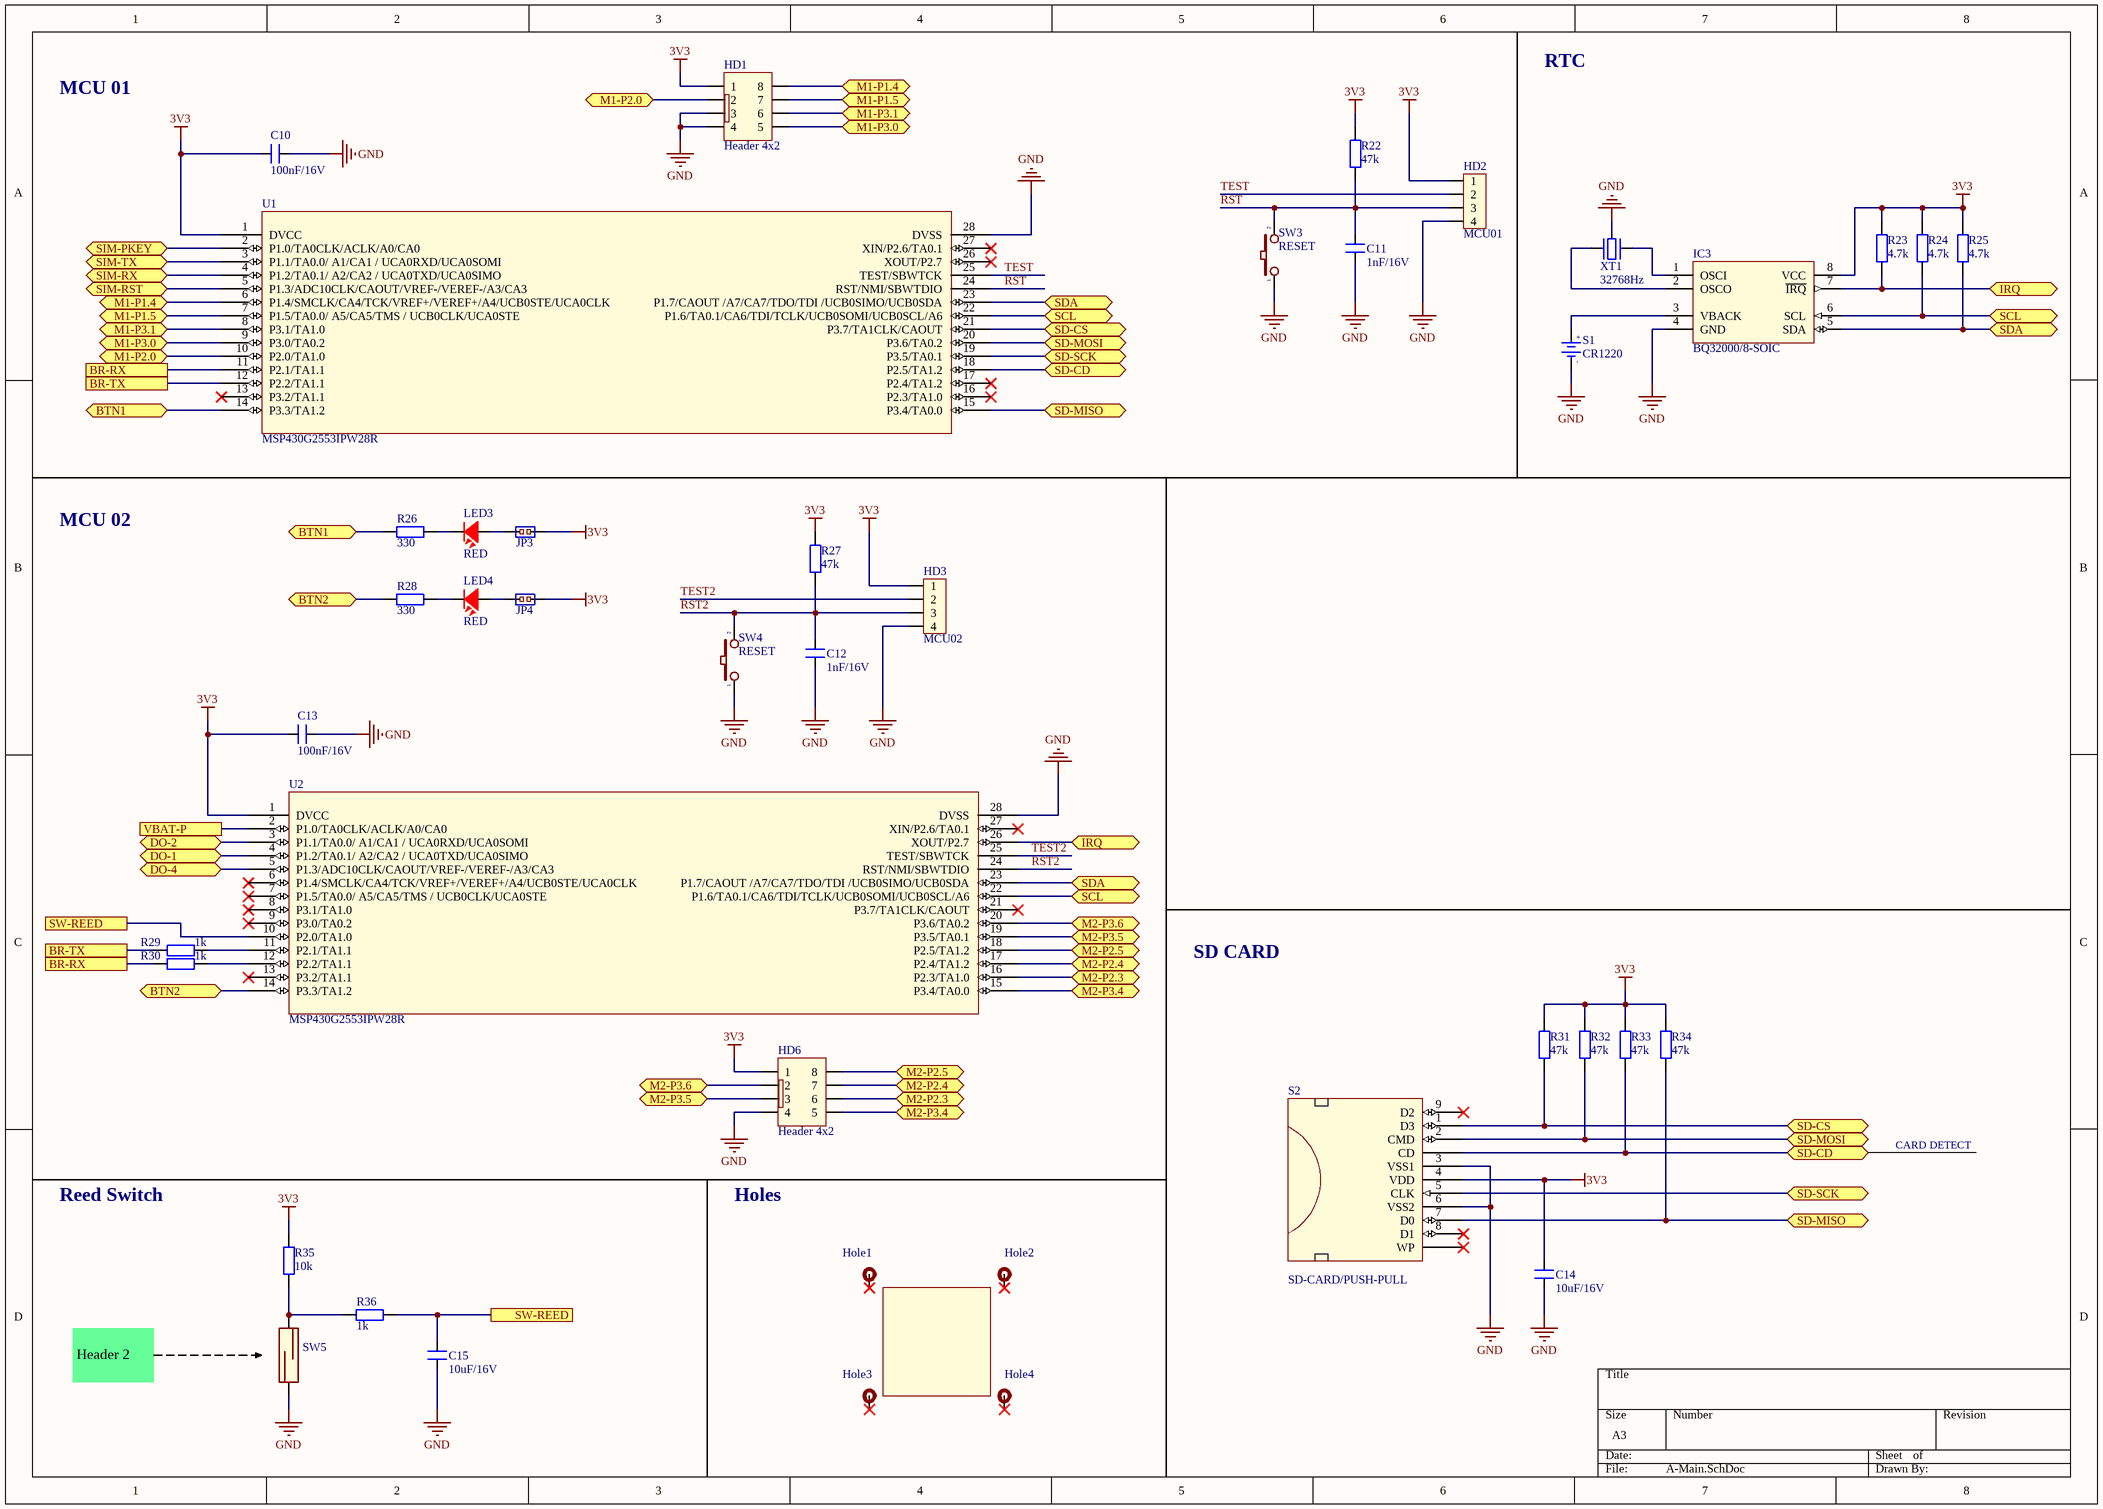
[diagram p1: A-Main.SchDoc]

### Parts
C10  100nF/16V  [C0805-2012]
C11  1nF/16V  [C0603-1608]
C12  1nF/16V  [C0603-1608]
C13  100nF/16V  [C0805-2012]
C14  10uF/16V  [C0805-2012]
C15  10uF/16V  [C0805-2012]
HD1  Header 4x2  [HeaderSP_4x2]
HD2  MCU01  [Header_4]
HD3  MCU02  [Header_4]
HD6  Header 4x2  [HeaderSP_4x2]
Hole1  Pad Big  [Screw 3.0]  (value not drawn)
Hole2  Pad Big  [Screw 3.0]  (value not drawn)
Hole3  Pad Big  [Screw 3.0]  (value not drawn)
Hole4  Pad Big  [Screw 3.0]  (value not drawn)
IC3  BQ32000/8-SOIC  [RTC-BQ32000]
JP3  JP2-ShortingJumper  [Header_2]  (value not drawn)
JP4  JP2-ShortingJumper  [Header_2]  (value not drawn)
LED3  RED  [Led 0805R]
LED4  RED  [Led 0805R]
R22  Resistance (Ohms): 47k  [RESC2012(0805)]
R23  Resistance (Ohms): 4.7k  [RESC2012(0805)]
R24  Resistance (Ohms): 4.7k  [RESC2012(0805)]
R25  Resistance (Ohms): 4.7k  [RESC2012(0805)]
R26  Resistance (Ohms): 330  [RESC2012(0805)]
R27  Resistance (Ohms): 47k  [RESC2012(0805)]
R28  Resistance (Ohms): 330  [RESC2012(0805)]
R29  Resistance (Ohms): 1k  [RESC2012(0805)]
R30  Resistance (Ohms): 1k  [RESC2012(0805)]
R31  Resistance (Ohms): 47k  [RESC2012(0805)]
R32  Resistance (Ohms): 47k  [RESC2012(0805)]
R33  Resistance (Ohms): 47k  [RESC2012(0805)]
R34  Resistance (Ohms): 47k  [RESC2012(0805)]
R35  Resistance (Ohms): 10k  [RESC2012(0805)]
R36  Resistance (Ohms): 1k  [RESC2012(0805)]
S1  value CR1220  [Socket-PIN-BC501SM-TR]  (hidden comment: BAT-HOLDER/CR1220/TME)
S2  SD-CARD/PUSH-PULL  [SD-CARD]
SW3  RESET  [BTN-EVQ-11A04M]
SW4  RESET  [BTN-EVQ-11A04M]
SW5  SW-REED/SPST/NO/350mA  [SWITCH-SDSM]  (value not drawn)
U1  MSP430G2553IPW28R  [MSP430G2253IPW28R]
U2  MSP430G2553IPW28R  [MSP430G2253IPW28R]
XT1  32768Hz  [CR_32768]

### Ports
BR-RX, BR-TX, BTN1 (bidir), BTN2 (bidir), DO-1 (bidir), DO-2 (bidir), DO-4 (bidir), IRQ (bidir), M1-P1.4 (bidir), M1-P1.5 (bidir), M1-P2.0 (bidir), M1-P3.0 (bidir), M1-P3.1 (bidir), M2-P2.3 (bidir), M2-P2.4 (bidir), M2-P2.5 (bidir), M2-P3.4 (bidir), M2-P3.5 (bidir), M2-P3.6 (bidir), SCL (bidir), SD-CD (bidir), SD-CS (bidir), SD-MISO (bidir), SD-MOSI (bidir), SD-SCK (bidir), SDA (bidir), SIM-PKEY (bidir), SIM-RST (bidir), SIM-RX (bidir), SIM-TX (bidir), SW-REED, VBAT-P

### Nets
3V3: C10.1 C13.1 C14.1 HD1.1 HD2.1 HD3.1 HD6.1 IC3.8(VCC) JP3.2 JP4.2 R22.2 R23.2 R24.2 R25.2 R27.2 R31.2 R32.2 R33.2 R34.2 R35.1 S2.4(VDD) U1.1(DVCC) U2.1(DVCC)
GND: C10.2 C11.2 C12.2 C13.2 C14.2 C15.2 HD1.3 HD1.4 HD2.4 HD3.4 HD6.4 IC3.4(GND) S1.2(GND) S2.3(VSS1) S2.6(VSS2) SW3.1 SW4.1 SW5.1 U1.28(DVSS) U2.28(DVSS) XT1.0(Case)
RST: C11.1 HD2.3 R22.1 SW3.2 U1.24(RST/NMI/SBWTDIO)
RST2: C12.1 HD3.3 R27.1 SW4.2 U2.24(RST/NMI/SBWTDIO)
TEST: HD2.2 U1.25(TEST/SBWTCK)
TEST2: HD3.2 U2.25(TEST/SBWTCK)
NetC15_1: C15.1 R36.1 U2.10(P2.0/TA1.0) ; port SW-REED
NetHD1_2: HD1.2 U1.10(P2.0/TA1.0) ; port M1-P2.0
NetHD1_5: HD1.5 U1.9(P3.0/TA0.2) ; port M1-P3.0
NetHD1_6: HD1.6 U1.8(P3.1/TA1.0) ; port M1-P3.1
NetHD1_7: HD1.7 U1.7(P1.5/TA0.0/_A5/CA5/TMS_/_UCB0CLK/UCA0STE) ; port M1-P1.5
NetHD1_8: HD1.8 U1.6(P1.4/SMCLK/CA4/TCK/VREF+/VEREF+/A4/UCB0STE/UCA0CLK) ; port M1-P1.4
NetHD6_2: HD6.2 U2.20(P3.6/TA0.2) ; port M2-P3.6
NetHD6_3: HD6.3 U2.19(P3.5/TA0.1) ; port M2-P3.5
NetHD6_5: HD6.5 U2.15(P3.4/TA0.0) ; port M2-P3.4
NetHD6_6: HD6.6 U2.16(P2.3/TA1.0) ; port M2-P2.3
NetHD6_7: HD6.7 U2.17(P2.4/TA1.2) ; port M2-P2.4
NetHD6_8: HD6.8 U2.18(P2.5/TA1.2) ; port M2-P2.5
NetIC3_1: IC3.1(OSCI) XT1.2
NetIC3_2: IC3.2(OSCO) XT1.1
NetIC3_3: IC3.3(VBACK) S1.1(+3V)
NetIC3_5: IC3.5(SDA) R25.1 U1.23(P1.7/CAOUT_/A7/CA7/TDO/TDI_/UCB0SIMO/UCB0SDA) U2.23(P1.7/CAOUT_/A7/CA7/TDO/TDI_/UCB0SIMO/UCB0SDA) ; port SDA
NetIC3_6: IC3.6(SCL) R24.1 U1.22(P1.6/TA0.1/CA6/TDI/TCLK/UCB0SOMI/UCB0SCL/A6) U2.22(P1.6/TA0.1/CA6/TDI/TCLK/UCB0SOMI/UCB0SCL/A6) ; port SCL
NetIC3_7: IC3.7(~{IRQ}) R23.1 U2.26(XOUT/P2.7) ; port IRQ
NetJP3_1: JP3.1 LED3.1(A)
NetJP4_1: JP4.1 LED4.1(A)
NetLED3_2: LED3.2(K) R26.1
NetLED4_2: LED4.2(K) R28.1
NetQ4_2: U1.3(P1.1/TA0.0/_A1/CA1_/_UCA0RXD/UCA0SOMI) ; port SIM-TX
NetQ5_2: U1.4(P1.2/TA0.1/_A2/CA2_/_UCA0TXD/UCA0SIMO) ; port SIM-RX
NetR1_1: U1.2(P1.0/TA0CLK/ACLK/A0/CA0) ; port SIM-PKEY
NetR15_1: U1.5(P1.3/ADC10CLK/CAOUT/VREF-/VEREF-/A3/CA3) ; port SIM-RST
NetR26_2: R26.2 U1.14(P3.3/TA1.2) ; port BTN1
NetR28_2: R28.2 U2.14(P3.3/TA1.2) ; port BTN2
NetR29_1: R29.1 U2.11(P2.1/TA1.1)
NetR29_2: R29.2 U1.12(P2.2/TA1.1) ; port BR-TX
NetR30_1: R30.1 U2.12(P2.2/TA1.1)
NetR30_2: R30.2 U1.11(P2.1/TA1.1) ; port BR-RX
NetR31_1: R31.1 S2.1(D3) U1.21(P3.7/TA1CLK/CAOUT) ; port SD-CS
NetR32_1: R32.1 S2.2(CMD) U1.20(P3.6/TA0.2) ; port SD-MOSI
NetR33_1: R33.1 S2.CD U1.18(P2.5/TA1.2) ; port SD-CD
NetR34_1: R34.1 S2.7(D0) U1.15(P3.4/TA0.0) ; port SD-MISO
NetR35_2: R35.2 R36.2 SW5.2
NetS2_5: S2.5(CLK) U1.19(P3.5/TA0.1) ; port SD-SCK
NetSB3_1: U2.2(P1.0/TA0CLK/ACLK/A0/CA0) ; port VBAT-P
NetU2_3: U2.3(P1.1/TA0.0/_A1/CA1_/_UCA0RXD/UCA0SOMI) ; port DO-2
NetU2_4: U2.4(P1.2/TA0.1/_A2/CA2_/_UCA0TXD/UCA0SIMO) ; port DO-1
NetU2_5: U2.5(P1.3/ADC10CLK/CAOUT/VREF-/VEREF-/A3/CA3) ; port DO-4

Not connected (* = marked no-connect by the designer): Hole1 1*; Hole2 1*; Hole3 1*; Hole4 1*; S2 8(D1)* 9(D2)* WP*; U1 13(P3.2/TA1.1)* 16(P2.3/TA1.0)* 17(P2.4/TA1.2)* 26(XOUT/P2.7)* 27(XIN/P2.6/TA0.1)*; U2 6(P1.4/SMCLK/CA4/TCK/VREF+/VEREF+/A4/UCB0STE/UCA0CLK)* 7(P1.5/TA0.0/_A5/CA5/TMS_/_UCB0CLK/UCA0STE)* 8(P3.1/TA1.0)* 9(P3.0/TA0.2)* 13(P3.2/TA1.1)* 21(P3.7/TA1CLK/CAOUT)* 27(XIN/P2.6/TA0.1)*

### Notes on the sheet
- MCU 01
- RTC
- MCU 02
- SD CARD
- CARD DETECT
- Reed Switch
- Holes
- Header 2
- Title
- Size:
- Date:
- A3
- Number:
- Time:
- Revision:
- Sheet
- of
- LẠI PHƯỚC SƠN
- elec2pcb@gmail.com
- elec2pcb.com
- File:
- (in symbol BAT-HOLDER/CR1220/TME) +; -

### Library data of the parts
C10 C13 = CAP-CER/100nF/16V/X7R/0805: as C1 on sheet A-GSM; Supplier 1: Digi-Key; RoHS: RoHS Compliant; Category: Capacitors; Stock 1: 366123; Pricing 1: 1=0.11, 10=0.075, 50=0.0432, 100=0.0356, 250=0.03, 500=0.02512, 1000=0.02063 (USD); Packaging: Cut Tape (CT); Voltage - Rated: 16V; Temperature Coefficient: X7R; Mounting Type: Surface Mount, MLCC; Operating Temperature: -55°C ~ 125°C; Applications: General Purpose; Ratings: -; Package / Case: 0805 (2012 Metric); Size / Dimension: 0.079" L x 0.049" W (2.00mm x 1.25mm); Height - Seated (Max): -; Thickness (Max): 0.035" (0.88mm); Lead Spacing: -; Features: Low ESL; Lead Style: -; ComponentLink1URL: http://www.kemet.com/docfinder?Partnumber=C0805C104K4RACTU; ComponentLink1Description: http://www.kemet.com/docfinder?Partnumber=C0805C104K4RACTU; Supplier Part Number 1: 399-1167-1-ND
C11 C12 = CAP-CER/1nF/16V/X7R/0603: CAP CER 1000PF 16V X7R 0603; Manufacturer: AVX Corporation; Manufacturer Part Number: 0603YC102KAT2A; Tolerance: ±10%; Supplier 1: Digi-Key; Supplier Part Number 1: 478-7933-1-ND; Stock: 28476; Pricing: 1=0.23, 10=0.157, 100=0.0798, 250=0.0646, 500=0.057, 1000=0.04845 (USD); Packaging: Cut Tape (CT); Capacitance: 1000pF; Voltage - Rated: 16V; Temperature Coefficient: X7R; Mounting Type: Surface Mount, MLCC; Operating Temperature: -55°C ~ 125°C; Applications: General Purpose; Ratings: -; Package / Case: 0603 (1608 Metric); Size / Dimension: 0.063" L x 0.032" W (1.60mm x 0.81mm); Height - Seated (Max): -; Thickness (Max): 0.035" (0.90mm); Lead Spacing: -; Features: -; Lead Style: -; ComponentLink1URL: http://www.avx.com/docs/Catalogs/cx7r.pdf; ComponentLink1Description: http://www.avx.com/docs/Catalogs/cx7r.pdf
C14 C15 = CAP-CER/10UF/16V/X5R/0805: as C3 on sheet A-GSM; Supplier 1: Digi-Key; Supplier Part Number 1: 490-3886-1-ND; Stock: 1364697; Pricing: 1=0.2, 10=0.136, 50=0.0826, 100=0.0693, 250=0.05612, 500=0.0495, 1000=0.04208 (USD); Packaging: Cut Tape (CT); Voltage - Rated: 16V; Temperature Coefficient: X5R; Mounting Type: Surface Mount, MLCC; Operating Temperature: -55°C ~ 85°C; Applications: General Purpose; Ratings: -; Package / Case: 0805 (2012 Metric); Size / Dimension: 0.079" L x 0.049" W (2.00mm x 1.25mm); Height - Seated (Max): -; Thickness (Max): 0.053" (1.35mm); Lead Spacing: -; Features: -; Lead Style: -; ComponentLink1URL: http://www.murata.com/~/media/webrenewal/support/library/catalog/products/capacitor/mlcc/c02e.ashx; ComponentLink1Description: http://www.murata.com/~/media/webrenewal/support/library/catalog/products/capacitor/mlcc/c02e.ashx
HD1 HD6 = HED-4X2/MALE/2.54MM-B: HEADER, 4X2, 2.54MM, MALE; Value: Header 4x2; Supplier Link: http://tme.vn/Product.aspx?id=516#page=pro_info
HD2 HD3 = Hed4: Header 4; Value: Header 4; Supplier Link: http://tme.vn/Product.aspx?id=518#page=pro_info
Hole1-Hole4 = Pad_Big: Value: Pad Big - Hole
IC3 = BQ32000/8-SOIC: IC RTC CLK/CALENDAR I2C 8-SOIC; Manufacturer: Texas Instruments; Manufacturer Part Number: BQ32000DR; Time Format: HH:MM:SS (24 hr); Date Format: YY-MM-DD-dd; Interface: I²C, 2-Wire Serial; Voltage - Supply: 3 V ~ 3.6 V; Voltage - Supply, Battery: 1.4 V ~ 3.6 V; Current - Timekeeping (Max): 100µA @ 3.3V; Supplier 1: Digi-Key; RoHS: RoHS Compliant; Category: Integrated Circuits (ICs); Stock 1: 4145; Pricing 1: 1=2.05, 10=1.843, 100=1.4783, 500=1.215, 1000=0.84375 (USD); Packaging: Cut Tape (CT); Type: Clock/Calendar; Features: Leap Year, Square Wave Output, Trickle-Charger; Memory Size: -; Operating Temperature: -40°C ~ 85°C; Mounting Type: Surface Mount; Package / Case: 8-SOIC (0.154", 3.90mm Width); Supplier Device Package: 8-SOIC; ComponentLink1URL: http://www.ti.com/lit/ds/symlink/bq32000.pdf; ComponentLink1Description: http://www.ti.com/lit/ds/symlink/bq32000.pdf; Supplier Part Number 1: 296-24583-1-ND
JP3 JP4 = JP2-ShortingJumper: 2.54mm 2-Pin Shorting Jumper; Value: Shorting Jumper; Supplier Link: http://tme.vn/Product.aspx?id=509#page=pro_info
LED3 LED4 = LED-RED/CLEAR/0805: as LED2 on sheet A-GSM; Supplier 1: Digi-Key; Supplier Part Number 1: 160-1427-1-ND; Stock: 74706; Pricing: 1=0.27, 10=0.213, 100=0.1161, 250=0.0774, 500=0.0658, 1000=0.05031 (USD); Packaging: Cut Tape (CT); Color: Red; Lens Transparency: Clear; Package / Case: 0805 (2012 Metric); Supplier Device Package: *; Size / Dimension: 2.00mm L x 1.25mm W; Height (Max): 0.80mm; Mounting Type: Surface Mount; ComponentLink1URL: http://optoelectronics.liteon.com/upload/download/DS22-2000-109/S_110_LTST-C171KRKT.pdf; ComponentLink1Description: http://optoelectronics.liteon.com/upload/download/DS22-2000-109/S_110_LTST-C171KRKT.pdf
R22 R27 R31-R34 = RES-0805/±5%: as R4 on sheet A-GSM; Supplier 1: Digi-Key; Supplier Part Number 1: 311-47KARCT-ND; RoHS: RoHS Compliant; Category: Resistors; Stock 1: 595084; Pricing 1: 1=0.1, 10=0.018, 25=0.0128, 100=0.0073, 250=0.00556, 500=0.00444, 1000=0.00326, 2500=0.00283 (USD); Packaging: Cut Tape (CT); Tolerance: ±5%; Composition: Thick Film; Features: Moisture Resistant; Operating Temperature: -55°C ~ 155°C; Package / Case: 0805 (2012 Metric); Supplier Device Package: 0805; Size / Dimension: 0.079" L x 0.049" W (2.00mm x 1.25mm); Height: 0.024" (0.60mm); Number of Terminations: 2; ComponentLink1URL: http://www.yageo.com/documents/recent/PYu-RC_Group_51_RoHS_L_04.pdf; ComponentLink1Description: http://www.yageo.com/documents/recent/PYu-RC_Group_51_RoHS_L_04.pdf
R23-R25 = RES-0805/±5%: as R1 on sheet A-GSM; Supplier 1: Digi-Key; Supplier Part Number 1: 311-4.7KARCT-ND; RoHS: RoHS Compliant; Category: Resistors; Stock 1: 891032; Pricing 1: 1=0.1, 10=0.018, 25=0.0128, 100=0.0073, 250=0.00556, 500=0.00444, 1000=0.00326, 2500=0.00283 (USD); Packaging: Cut Tape (CT); Tolerance: ±5%; Composition: Thick Film; Features: Moisture Resistant; Operating Temperature: -55°C ~ 155°C; Package / Case: 0805 (2012 Metric); Supplier Device Package: 0805; Size / Dimension: 0.079" L x 0.049" W (2.00mm x 1.25mm); Height: 0.024" (0.60mm); Number of Terminations: 2; ComponentLink1URL: http://www.yageo.com/documents/recent/PYu-RC_Group_51_RoHS_L_04.pdf; ComponentLink1Description: http://www.yageo.com/documents/recent/PYu-RC_Group_51_RoHS_L_04.pdf
R26 R28 = RES-0805/±5%: as R2 on sheet A-GSM; Supplier 1: Digi-Key; Supplier Part Number 1: 311-330ARCT-ND; RoHS: RoHS Compliant; Category: Resistors; Stock 1: 538867; Pricing 1: 1=0.1, 10=0.018, 25=0.0128, 100=0.0073, 250=0.00556, 500=0.00444, 1000=0.00326, 2500=0.00283 (USD); Packaging: Cut Tape (CT); Tolerance: ±5%; Composition: Thick Film; Features: Moisture Resistant; Operating Temperature: -55°C ~ 155°C; Package / Case: 0805 (2012 Metric); Supplier Device Package: 0805; Size / Dimension: 0.079" L x 0.049" W (2.00mm x 1.25mm); Height: 0.024" (0.60mm); Number of Terminations: 2; ComponentLink1URL: http://www.yageo.com/documents/recent/PYu-RC_Group_51_RoHS_L_04.pdf; ComponentLink1Description: http://www.yageo.com/documents/recent/PYu-RC_Group_51_RoHS_L_04.pdf
R29 R30 R36 = RES-0805/±5%: RES SMD 1K OHM 5% 1/8W 0805; Manufacturer: Yageo; Manufacturer Part Number: RC0805JR-071KL; Power (Watts): 0.125W, 1/8W; Temperature Coefficient: ±100ppm/°C; Supplier 1: Digi-Key; Supplier Part Number 1: 311-1.0KARCT-ND; RoHS: RoHS Compliant; Category: Resistors; Stock 1: 1526483; Pricing 1: 1=0.1, 10=0.018, 25=0.0128, 100=0.0073, 250=0.00556, 500=0.00444, 1000=0.00326, 2500=0.00283 (USD); Packaging: Cut Tape (CT); Tolerance: ±5%; Composition: Thick Film; Features: Moisture Resistant; Operating Temperature: -55°C ~ 155°C; Package / Case: 0805 (2012 Metric); Supplier Device Package: 0805; Size / Dimension: 0.079" L x 0.049" W (2.00mm x 1.25mm); Height: 0.024" (0.60mm); Number of Terminations: 2; ComponentLink1URL: http://www.yageo.com/documents/recent/PYu-RC_Group_51_RoHS_L_04.pdf; ComponentLink1Description: http://www.yageo.com/documents/recent/PYu-RC_Group_51_RoHS_L_04.pdf
R35 = RES-0805/±5%: as R9 on sheet A-GSM; Supplier 1: Digi-Key; Supplier Part Number 1: 311-10KARCT-ND; RoHS: RoHS Compliant; Category: Resistors; Stock 1: 1117583; Pricing 1: 1=0.1, 10=0.018, 25=0.0128, 100=0.0073, 250=0.00556, 500=0.00444, 1000=0.00326, 2500=0.00283 (USD); Packaging: Cut Tape (CT); Tolerance: ±5%; Composition: Thick Film; Features: Moisture Resistant; Operating Temperature: -55°C ~ 155°C; Package / Case: 0805 (2012 Metric); Supplier Device Package: 0805; Size / Dimension: 0.079" L x 0.049" W (2.00mm x 1.25mm); Height: 0.024" (0.60mm); Number of Terminations: 2; ComponentLink1URL: http://www.yageo.com/documents/recent/PYu-RC_Group_51_RoHS_L_04.pdf; ComponentLink1Description: http://www.yageo.com/documents/recent/PYu-RC_Group_51_RoHS_L_04.pdf
S1 = BAT-HOLDER/CR1220/TME: CR1220 Battery Holder SMD; Supplier Link: http://tme.vn/Product.aspx?id=1796#page=pro_info; ComponentLink1URL: http://www.memoryprotectiondevices.com/datasheets/BC501SM-TR-datasheet.pdf; ComponentLink1Description: http://www.memoryprotectiondevices.com/datasheets/BC501SM-TR-datasheet.pdf; Supplier 1: TME.VN
S2 = SD-CARD/PUSH-PULL: CONN SD CARD PUSH-PUSH R/A SMD; Manufacturer: Amphenol Commercial Products; Manufacturer Part Number: 101-00313-68-02; Card Type: Secure Digital - SD; Number of Positions: 9; Connector Type: Connector and Ejector; Insertion, Removal Method: Push In, Push Out; Supplier 1: Digi-Key; RoHS: RoHS Compliant; Category: Connectors, Interconnects; Stock 1: 7364; Pricing 1: 1=2.33, 10=2.11, 25=1.9808, 50=1.8948, 100=1.8087 (USD); Packaging: Cut Tape (CT); Ejector Side: -; Mounting Type: Surface Mount, Right Angle; Features: Board Guide; Height Above Board: 0.106" (2.70mm); Mounting Feature: Normal, Standard - Top; Contact Finish: Gold; Contact Finish Thickness: 15µin (0.38µm); ComponentLink1URL: http://media.digikey.com/pdf/Data%20Sheets/Amphenol%20PDFs/101-00313.pdf; ComponentLink1Description: http://media.digikey.com/pdf/Data%20Sheets/Amphenol%20PDFs/101-00313.pdf; Supplier Part Number 1: 101-00313-68-02CT-ND
SW3 SW4 = SW2-PUSH/SPST/NO: as SW1 on sheet A-GSM; Supplier 1: Digi-Key; RoHS: RoHS Compliant; Category: Switches; Stock 1: 4758; Pricing 1: 1=0.29, 10=0.273, 25=0.2344, 50=0.1992, 100=0.1913, 250=0.17184, 500=0.16402, 1000=0.13668 (USD); Packaging: Cut Tape (CT); Circuit: SPST-NO; Mounting Type: Through Hole; Termination Style: PC Pin; Illumination Voltage (Nominal): -; Illumination Type, Color: -; Ingress Protection: -; Features: -; Actuator Material: -; Operating Temperature: -20°C ~ 70°C; ComponentLink1URL: http://industrial.panasonic.com/cdbs/www-data/pdf/ATK0000/ATK0000CE11.pdf; ComponentLink1Description: http://industrial.panasonic.com/cdbs/www-data/pdf/ATK0000/ATK0000CE11.pdf; Supplier Part Number 1: P8070SCT-ND
SW5 = SW-REED/SPST/NO/350mA: SWITCH REED SPST-NO 350MA 140V; Manufacturer: Littelfuse Inc.; Manufacturer Part Number: MDSM-4R-12-18; Operate Range: 12 ~ 18AT; Current - Switching: 350mA (AC), 500mA (DC); Voltage - Switching DC: 200V; Power - Rated: 10W; Operate Time: 0.6ms; Release Time: 0.2ms; Capacitance: 0.20pF; Current - Carry: 1.2A (DC); Supplier 1: Digi-Key; RoHS: RoHS Compliant; Category: Switches; Stock 1: 153096; Pricing 1: 1=0.74, 10=0.693, 25=0.6236, 100=0.5313, 250=0.48512, 500=0.462, 1000=0.38115 (USD); Packaging: Cut Tape (CT); Type: Glass Body; Circuit: SPST-NO; Release Range: -; Voltage - Switching AC: 140V; Mounting Type: Surface Mount; Termination Style: Gull Wing; Length - Overall: 0.760" (19.30mm); Size - Body: 0.090" Dia x 0.600" L (2.28mm x 15.24mm); Height Above Board: 0.112" (2.85mm); Operating Temperature: -40°C ~ 125°C; ComponentLink1URL: http://www.littelfuse.com/~/media/electronics/datasheets/reed_switches/littelfuse_reed_switches_mdsm_4_datasheet.pdf.pdf; ComponentLink1Description: http://www.littelfuse.com/~/media/electronics/datasheets/reed_switches/littelfuse_reed_switches_mdsm_4_datasheet.pdf.pdf; Supplier Part Number 1: HE151CT-ND
U1 U2 = MSP430G2553IPW28R: IC MCU 16BIT 16KB FLASH 28TSSOP; Manufacturer: Texas Instruments; Core Processor: MSP430; Core Size: 16-Bit; Speed: 16MHz; Connectivity: I²C, IrDA, LIN, SCI, SPI, UART/USART; Peripherals: Brown-out Detect/Reset, DMA, POR, PWM, WDT; Number of I/O: 24; Program Memory Size: 16KB (16K x 8); RAM Size: 512 x 8; Voltage - Supply (Vcc/Vdd): 1.8 V ~ 3.6 V; Data Converters: A/D 8x10b; Oscillator Type: Internal; Supplier 1: Digi-Key; Manufacturer Part Number: MSP430G2553IPW28R; RoHS: RoHS Compliant; Category: Integrated Circuits (ICs); Stock 1: 6523; Pricing 1: 1=2.6, 10=2.334, 100=1.8725, 500=1.539, 1000=1.06875 (USD); Packaging: Cut Tape (CT); Program Memory Type: FLASH; EEPROM Size: -; Operating Temperature: -40°C ~ 85°C (TA); Package / Case: 28-TSSOP (0.173", 4.40mm Width); Supplier Device Package: 28-TSSOP; ComponentLink1URL: http://www.ti.com/lit/ds/symlink/msp430g2553.pdf; ComponentLink1Description: http://www.ti.com/lit/ds/symlink/msp430g2553.pdf; Supplier Part Number 1: 296-28431-1-ND
XT1 = XT-32768HZ/RADIAL: CRYSTAL 32.7680KHZ 12.5PF T/H; Manufacturer: Citizen Finedevice Co Ltd; Manufacturer Part Number: CFS206-32.768KDZF-UB; Frequency: 32.768kHz; Frequency Tolerance: ±20ppm; ESR (Equivalent Series Resistance): 35 kOhm; Operating Mode: Fundamental; Supplier 1: Digi-Key; RoHS: RoHS Compliant; Category: Crystals and Oscillators; Stock 1: 53709; Pricing 1: 1=0.24, 10=0.2, 50=0.18, 100=0.16, 500=0.152, 1000=0.128, 2500=0.12, 5000=0.116 (USD); Packaging: Bulk; Type: kHz Crystal (Tuning Fork); Frequency Stability: -; Load Capacitance: 12.5pF; Operating Temperature: -20°C ~ 70°C; Ratings: -; Mounting Type: Through Hole; Package / Case: Cylindrical Can, Radial; Size / Dimension: 0.075" Dia (1.90mm); Height: 0.244" (6.20mm); ComponentLink1URL: http://cfd.citizen.co.jp/english/prod-tech/product/pdf/datasheet_TF/CFS-145%20CFS-206%20CFV-206_E.pdf; ComponentLink1Description: http://cfd.citizen.co.jp/english/prod-tech/product/pdf/datasheet_TF/CFS-145%20CFS-206%20CFV-206_E.pdf; Supplier Part Number 1: 300-1002-ND